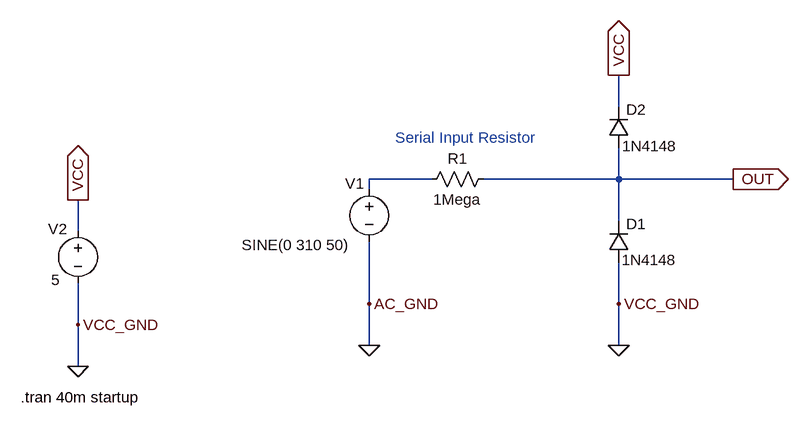
[diagram p0: schematic Zero Cross.asc]
Zero Cross.asc, the LTspice schematic file:
Version 4
SHEET 1 1784 680
WIRE 880 -464 880 -512
WIRE 592 -352 496 -352
WIRE 880 -352 880 -400
WIRE 880 -352 672 -352
WIRE 1056 -352 880 -352
WIRE 496 -336 496 -352
WIRE 880 -288 880 -352
WIRE 48 -272 48 -320
WIRE 496 -160 496 -256
WIRE 880 -160 880 -224
WIRE 48 -128 48 -192
WIRE 496 -96 496 -160
WIRE 880 -96 880 -160
WIRE 48 -64 48 -128
FLAG 1056 -352 OUT
IOPIN 1056 -352 Out
FLAG 48 -320 VCC
IOPIN 48 -320 Out
FLAG 880 -512 VCC
IOPIN 880 -512 Out
FLAG 48 -64 0
FLAG 880 -96 0
FLAG 496 -160 AC_GND
FLAG 48 -128 VCC_GND
FLAG 880 -160 VCC_GND
FLAG 496 -96 0
SYMBOL voltage 496 -352 R0
WINDOW 0 -37 7 Left 2
WINDOW 3 -196 101 Left 2
WINDOW 123 0 0 Left 0
WINDOW 39 0 0 Left 0
SYMATTR InstName V1
SYMATTR Value SINE(0 310 50)
SYMBOL res 688 -368 R90
WINDOW 0 0 56 VBottom 2
WINDOW 3 32 56 VTop 2
SYMATTR InstName R1
SYMATTR Value 1Mega
SYMATTR SpiceLine pwr=0.5
SYMBOL diode 896 -400 R180
WINDOW 0 -26 59 Left 2
WINDOW 3 -74 3 Left 2
SYMATTR InstName D2
SYMATTR Value 1N4148
SYMBOL diode 896 -224 R180
WINDOW 0 -26 59 Left 2
WINDOW 3 -73 4 Left 2
SYMATTR InstName D1
SYMATTR Value 1N4148
SYMBOL voltage 48 -288 R0
WINDOW 0 -46 13 Left 2
WINDOW 3 -41 91 Left 2
WINDOW 123 0 0 Left 0
WINDOW 39 0 0 Left 0
SYMATTR InstName V2
SYMATTR Value 5
TEXT -40 -16 Left 2 !.tran 40m startup
TEXT 536 -416 Left 2 ;Serial Input Resistor

The netlist it stands for:
* Zero Cross.asc
V1 N001 0 SINE(0 310 50)
R1 OUT N001 1Mega pwr=0.5
D2 OUT VCC 1N4148
D1 0 OUT 1N4148
V2 VCC 0 5
.model D D
.lib standard.dio
.tran 40m startup
* Serial Input Resistor
.backanno
.end